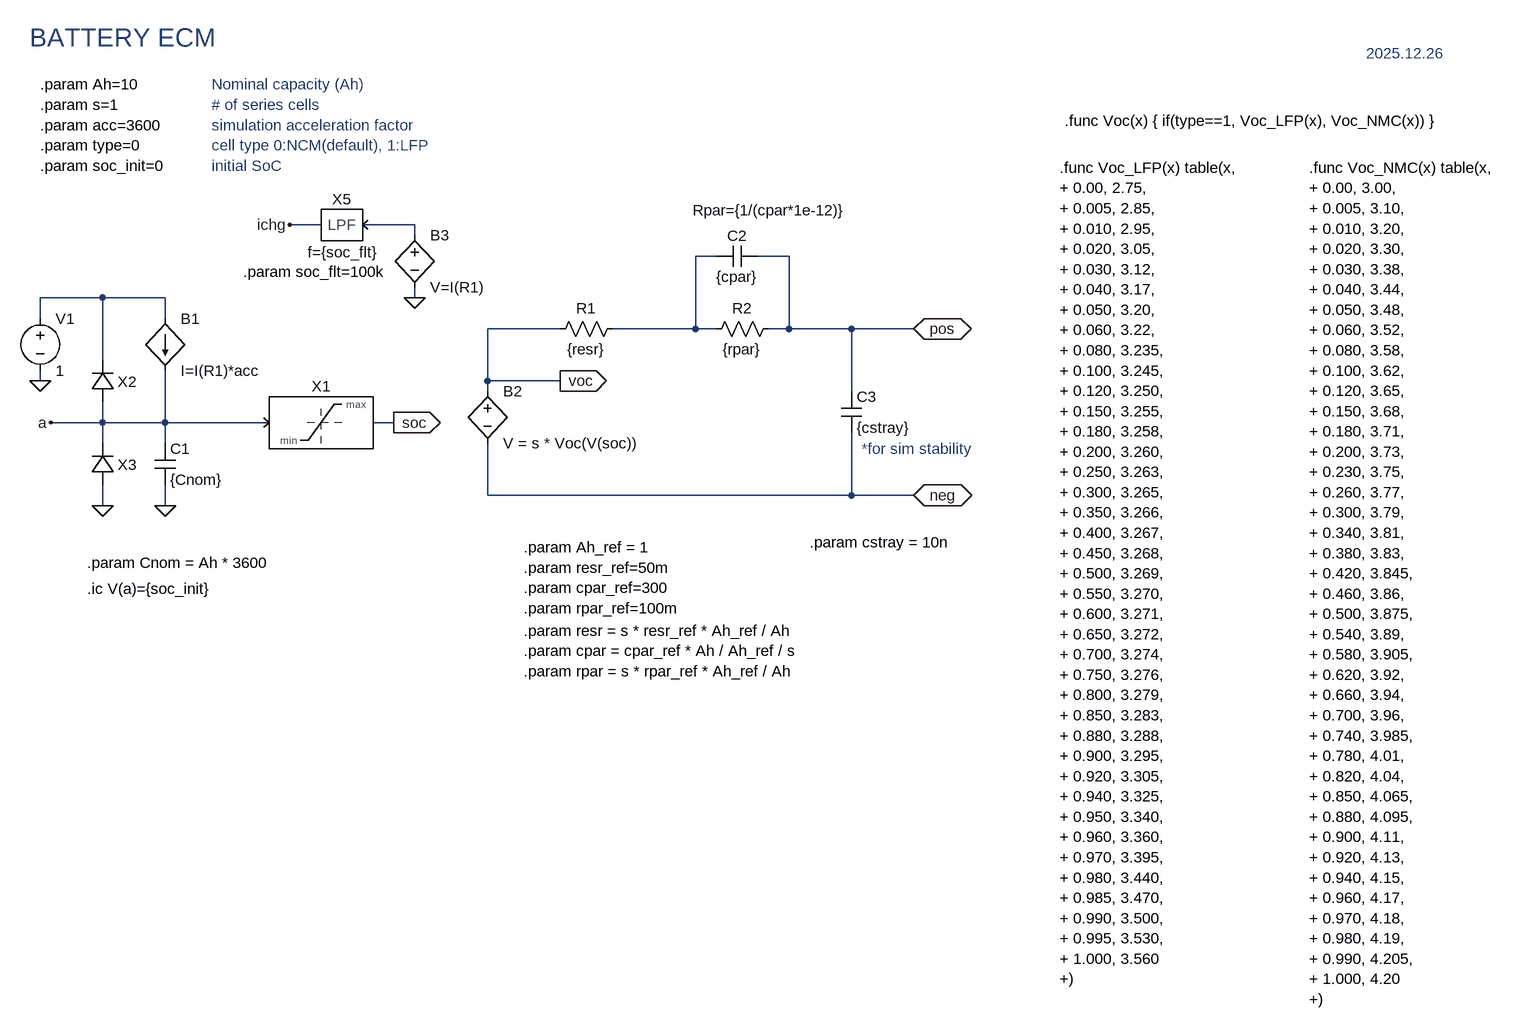
[diagram p0: schematic BATTERY_ECM.asc]
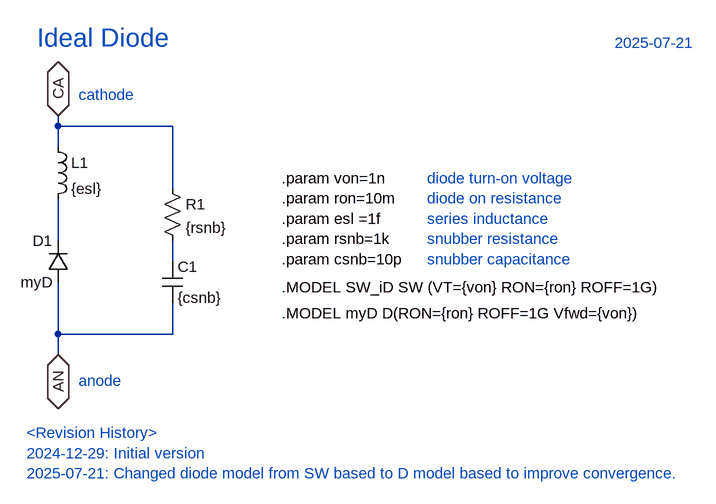
[diagram p1: sub-circuit id.asc]
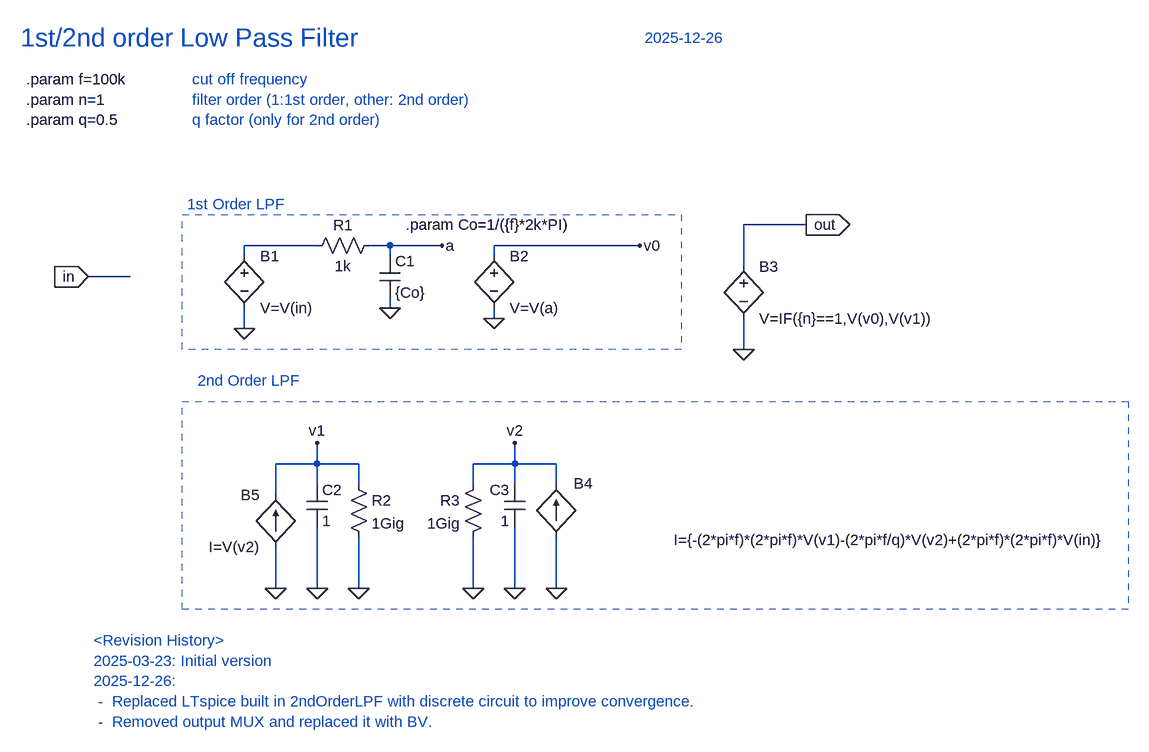
[diagram p2: sub-circuit lpf.asc]
BATTERY_ECM.asc, the LTspice schematic file:
Version 4.1
SHEET 1 1876 1176
WIRE 48 -176 0 -176
WIRE 192 -176 112 -176
WIRE 192 -160 192 -176
WIRE 656 -128 624 -128
WIRE 768 -128 720 -128
WIRE -288 -64 -384 -64
WIRE -192 -64 -288 -64
WIRE 192 -64 192 -80
WIRE -384 -32 -384 -64
WIRE -192 -32 -192 -64
WIRE 416 -16 304 -16
WIRE 624 -16 624 -128
WIRE 624 -16 496 -16
WIRE 656 -16 624 -16
WIRE 768 -16 768 -128
WIRE 768 -16 736 -16
WIRE 864 -16 768 -16
WIRE 960 -16 864 -16
WIRE -288 32 -288 -64
WIRE -384 64 -384 48
WIRE 304 64 304 -16
WIRE 416 64 304 64
WIRE 304 80 304 64
WIRE 864 80 864 -16
WIRE -288 128 -288 96
WIRE -288 128 -368 128
WIRE -192 128 -192 48
WIRE -192 128 -288 128
WIRE -32 128 -192 128
WIRE 160 128 128 128
WIRE -288 160 -288 128
WIRE -192 160 -192 128
WIRE 304 240 304 160
WIRE 864 240 864 144
WIRE 864 240 304 240
WIRE 960 240 864 240
WIRE -288 256 -288 224
WIRE -192 256 -192 224
FLAG -192 256 0
FLAG 160 128 soc
IOPIN 160 128 Out
FLAG -384 64 0
FLAG 416 64 voc
IOPIN 416 64 Out
FLAG 960 240 neg
IOPIN 960 240 BiDir
FLAG 960 -16 pos
IOPIN 960 -16 BiDir
FLAG -368 128 a
FLAG -288 256 0
FLAG 0 -176 ichg
FLAG 192 -64 0
SYMBOL cap -208 160 R0
SYMATTR InstName C1
SYMATTR Value {Cnom}
SYMATTR SpiceLine Rpar=10000Gig
SYMBOL bi -192 -32 R0
SYMATTR InstName B1
SYMATTR Value I=I(R1)*acc
SYMBOL voltage -384 -48 R0
WINDOW 123 0 0 Left 0
WINDOW 39 0 0 Left 0
SYMATTR InstName V1
SYMATTR Value 1
SYMBOL bv 304 64 R0
SYMATTR InstName B2
SYMATTR Value V = s * Voc(V(soc))
SYMBOL res 512 -32 R90
WINDOW 0 0 56 VBottom 2
WINDOW 3 32 56 VTop 2
SYMATTR InstName R1
SYMATTR Value {resr}
SYMBOL res 752 -32 R90
WINDOW 0 0 56 VBottom 2
WINDOW 3 32 56 VTop 2
SYMATTR InstName R2
SYMATTR Value {rpar}
SYMBOL cap 720 -144 R90
WINDOW 0 0 32 VBottom 2
WINDOW 3 32 32 VTop 2
WINDOW 39 -39 -19 VBottom 2
SYMATTR InstName C2
SYMATTR Value {cpar}
SYMATTR SpiceLine Rpar={1/(cpar*1e-12)}
SYMBOL PowerSim\\LIMIT 48 128 R0
SYMATTR InstName X1
SYMBOL iD -288 64 R180
SYMATTR InstName X2
SYMATTR Value von=1n ron=1n
SYMBOL iD -288 192 R180
SYMATTR InstName X3
SYMATTR Value von=1n ron=1n
SYMBOL PowerSim\\LPF 80 -176 M0
WINDOW 3 -1 58 Bottom 2
SYMATTR Value f={soc_flt}
SYMATTR InstName X5
SYMBOL bv 192 -176 R0
SYMATTR InstName B3
SYMATTR Value V=I(R1)
SYMBOL cap 848 80 R0
SYMATTR InstName C3
SYMATTR Value {cstray}
TEXT 1184 -264 Left 2 !.func Voc_LFP(x) table(x,\n+ 0.00, 2.75,\n+ 0.005, 2.85,\n+ 0.010, 2.95,\n+ 0.020, 3.05,\n+ 0.030, 3.12,\n+ 0.040, 3.17,\n+ 0.050, 3.20,\n+ 0.060, 3.22,\n+ 0.080, 3.235,\n+ 0.100, 3.245,\n+ 0.120, 3.250,\n+ 0.150, 3.255,\n+ 0.180, 3.258,\n+ 0.200, 3.260,\n+ 0.250, 3.263,\n+ 0.300, 3.265,\n+ 0.350, 3.266,\n+ 0.400, 3.267,\n+ 0.450, 3.268,\n+ 0.500, 3.269,\n+ 0.550, 3.270,\n+ 0.600, 3.271,\n+ 0.650, 3.272,\n+ 0.700, 3.274,\n+ 0.750, 3.276,\n+ 0.800, 3.279,\n+ 0.850, 3.283,\n+ 0.880, 3.288,\n+ 0.900, 3.295,\n+ 0.920, 3.305,\n+ 0.940, 3.325,\n+ 0.950, 3.340,\n+ 0.960, 3.360,\n+ 0.970, 3.395,\n+ 0.980, 3.440,\n+ 0.985, 3.470,\n+ 0.990, 3.500,\n+ 0.995, 3.530,\n+ 1.000, 3.560\n+)
TEXT -384 -392 Left 2 !.param Ah=10\n.param s=1\n.param acc=3600\n.param type=0\n.param soc_init=0
TEXT -120 -392 Left 2 ;Nominal capacity (Ah)\n# of series cells\nsimulation acceleration factor\ncell type 0:NCM(default), 1:LFP\ninitial SoC
TEXT 360 320 Left 2 !.param Ah_ref = 1\n.param resr_ref=50m\n.param cpar_ref=300\n.param rpar_ref=100m
TEXT 360 448 Left 2 !.param resr = s * resr_ref * Ah_ref / Ah\n.param cpar = cpar_ref * Ah / Ah_ref / s\n.param rpar = s * rpar_ref * Ah_ref / Ah
TEXT -312 344 Left 2 !.param Cnom = Ah * 3600
TEXT 1192 -336 Left 2 !.func Voc(x) { if(type==1, Voc_LFP(x), Voc_NMC(x)) }
TEXT 1568 -264 Left 2 !.func Voc_NMC(x) table(x,\n+ 0.00, 3.00,\n+ 0.005, 3.10,\n+ 0.010, 3.20,\n+ 0.020, 3.30,\n+ 0.030, 3.38,\n+ 0.040, 3.44,\n+ 0.050, 3.48,\n+ 0.060, 3.52,\n+ 0.080, 3.58,\n+ 0.100, 3.62,\n+ 0.120, 3.65,\n+ 0.150, 3.68,\n+ 0.180, 3.71,\n+ 0.200, 3.73,\n+ 0.230, 3.75,\n+ 0.260, 3.77,\n+ 0.300, 3.79,\n+ 0.340, 3.81,\n+ 0.380, 3.83,\n+ 0.420, 3.845,\n+ 0.460, 3.86,\n+ 0.500, 3.875,\n+ 0.540, 3.89,\n+ 0.580, 3.905,\n+ 0.620, 3.92,\n+ 0.660, 3.94,\n+ 0.700, 3.96,\n+ 0.740, 3.985,\n+ 0.780, 4.01,\n+ 0.820, 4.04,\n+ 0.850, 4.065,\n+ 0.880, 4.095,\n+ 0.900, 4.11,\n+ 0.920, 4.13,\n+ 0.940, 4.15,\n+ 0.960, 4.17,\n+ 0.970, 4.18,\n+ 0.980, 4.19,\n+ 0.990, 4.205,\n+ 1.000, 4.20\n+)
TEXT -312 384 Left 2 !.ic V(a)={soc_init}
TEXT -400 -464 Left 4 ;BATTERY ECM
TEXT 1656 -440 Left 2 ;2025.12.26
TEXT -72 -104 Left 2 !.param soc_flt=100k
TEXT 800 312 Left 2 !.param cstray = 10n
TEXT 880 168 Left 2 ;*for sim stability

id.asc, the sub-circuit schematic file:
Version 4.1
SHEET 1 1728 680
WIRE 624 -288 624 -304
WIRE 800 -288 624 -288
WIRE 624 -256 624 -288
WIRE 800 -192 800 -288
WIRE 624 -112 624 -176
WIRE 800 -80 800 -112
WIRE 624 32 624 -48
WIRE 800 32 800 -16
WIRE 800 32 624 32
WIRE 624 64 624 32
FLAG 624 -304 CA
IOPIN 624 -304 BiDir
FLAG 624 64 AN
IOPIN 624 64 BiDir
SYMBOL res 784 -208 R0
SYMATTR InstName R1
SYMATTR Value {rsnb}
SYMBOL cap 784 -80 R0
SYMATTR InstName C1
SYMATTR Value {csnb}
SYMBOL ind 608 -272 R0
SYMATTR InstName L1
SYMATTR Value {esl}
SYMBOL diode 640 -48 R180
WINDOW 0 24 64 Left 2
WINDOW 3 24 0 Left 2
SYMATTR InstName D1
SYMATTR Value myD
TEXT 968 -40 Left 2 !.MODEL SW_iD SW (VT={von} RON={ron} ROFF=1G)
TEXT 968 -208 Left 2 !.param von=1n\n.param ron=10m\n.param esl =1f\n.param rsnb=1k\n.param csnb=10p
TEXT 592 -424 Left 4 ;Ideal Diode
TEXT 656 -336 Left 2 ;cathode
TEXT 656 104 Left 2 ;anode
TEXT 1192 -208 Left 2 ;diode turn-on voltage\ndiode on resistance\nseries inductance\nsnubber resistance\nsnubber capacitance
TEXT 1480 -416 Left 2 ;2025-07-21
TEXT 576 184 Left 2 ;<Revision History>\n2024-12-29: Initial version\n2025-07-21: Changed diode model from SW based to D model based to improve convergence.
TEXT 968 0 Left 2 !.MODEL myD D(RON={ron} ROFF=1G Vfwd={von})

lpf.asc, the sub-circuit schematic file:
Version 4.1
SHEET 1 1652 804
WIRE 944 -80 848 -80
WIRE 192 -48 80 -48
WIRE 304 -48 272 -48
WIRE 384 -48 304 -48
WIRE 688 -48 464 -48
WIRE 80 -32 80 -48
WIRE 304 -32 304 -48
WIRE 464 -32 464 -48
WIRE 848 -16 848 -80
WIRE -96 0 -160 0
WIRE 304 48 304 32
WIRE 464 64 464 48
WIRE 80 80 80 48
WIRE 848 112 848 64
WIRE 192 288 192 256
WIRE 192 288 128 288
WIRE 256 288 192 288
WIRE 496 288 496 256
WIRE 496 288 432 288
WIRE 560 288 496 288
WIRE 192 320 192 288
WIRE 256 320 256 288
WIRE 432 320 432 288
WIRE 496 320 496 288
WIRE 560 320 560 288
WIRE 128 336 128 288
WIRE 128 480 128 416
WIRE 192 480 192 384
WIRE 256 480 256 400
WIRE 432 480 432 400
WIRE 496 480 496 384
WIRE 560 480 560 400
FLAG -160 0 in
IOPIN -160 0 In
FLAG 944 -80 out
IOPIN 944 -80 Out
FLAG 304 48 0
FLAG 80 80 0
FLAG 384 -48 a
FLAG 464 64 0
FLAG 848 112 0
FLAG 256 480 0
FLAG 192 256 v1
FLAG 496 256 v2
FLAG 128 480 0
FLAG 560 480 0
FLAG 688 -48 v0
FLAG 192 480 0
FLAG 496 480 0
FLAG 432 480 0
SYMBOL res 288 -64 R90
WINDOW 0 0 56 VBottom 2
WINDOW 3 32 56 VTop 2
SYMATTR InstName R1
SYMATTR Value 1k
SYMBOL cap 288 -32 R0
SYMATTR InstName C1
SYMATTR Value {Co}
SYMBOL bv 80 -48 R0
SYMATTR InstName B1
SYMATTR Value V=V(in)
SYMBOL bv 464 -48 R0
SYMATTR InstName B2
SYMATTR Value V=V(a)
SYMBOL bv 848 -32 R0
SYMATTR InstName B3
SYMATTR Value V=IF({n}==1,V(v0),V(v1))
SYMBOL res 240 304 R0
SYMATTR InstName R2
SYMATTR Value 1Gig
SYMBOL cap 176 320 R0
SYMATTR InstName C2
SYMATTR Value 1
SYMBOL bi 128 416 R180
WINDOW 0 24 80 Left 2
WINDOW 3 24 0 Left 2
SYMATTR InstName B5
SYMATTR Value I=V(v2)
SYMBOL res 448 304 M0
SYMATTR InstName R3
SYMATTR Value 1Gig
SYMBOL cap 512 320 M0
SYMATTR InstName C3
SYMATTR Value 1
SYMBOL bi 560 400 R180
WINDOW 3 -848 -5 Left 2
WINDOW 0 -56 82 Left 2
SYMATTR Value I={-(2*pi*f)*(2*pi*f)*V(v1)-(2*pi*f/q)*V(v2)+(2*pi*f)*(2*pi*f)*V(in)}
SYMATTR InstName B4
TEXT -264 -368 Left 4 ;1st/2nd order Low Pass Filter
TEXT 696 -368 Left 2 ;2025-12-26
TEXT -256 -304 Left 2 !.param f=100k\n.param n=1\n.param q=0.5
TEXT 328 -80 Left 2 !.param Co=1/({f}*2k*PI)
TEXT 0 -304 Left 2 ;cut off frequency\nfilter order (1:1st order, other: 2nd order)\nq factor (only for 2nd order)
TEXT -8 -112 Left 2 ;1st Order LPF
TEXT 8 160 Left 2 ;2nd Order LPF
TEXT -152 560 Left 2 ;<Revision History>\n2025-03-23: Initial version\n2025-12-26: \n -  Replaced LTspice built in 2ndOrderLPF with discrete circuit to improve convergence.\n -  Removed output MUX and replaced it with BV.
RECTANGLE Normal 752 112 -16 -96 2
RECTANGLE Normal 1440 512 -16 192 2

The netlist it stands for:
* BATTERY_ECM.asc
C1 a 0 {Cnom} Rpar=10000Gig
B1 N003 a I=I(R1)*acc
V1 N003 0 1
B2 voc neg V = s * Voc(V(soc))
R1 N002 voc {resr}
R2 pos N002 {rpar}
C2 pos N002 {cpar} Rpar={1/(cpar*1e-12)}
X§X1 a soc LIMIT max=1 min=0  ; pins in out
X§X2 a N003 id params: von=1n ron=1n esl=1f rsnb=1k csnb=10p
X§X3 0 a id params: von=1n ron=1n esl=1f rsnb=1k csnb=10p
X§X5 N001 ichg lpf params: f={soc_flt} n=1 q=0.5
B3 N001 0 V=I(R1)
C3 pos neg {cstray}

* block symbol definitions
.subckt id AN CA
R1 CA N002 {rsnb}
C1 N002 AN {csnb}
L1 CA N001 {esl}
D1 AN N001 myD
.MODEL SW_iD SW (VT={von} RON={ron} ROFF=1G)
.param von=1n
.param ron=10m
.param esl =1f
.param rsnb=1k
.param csnb=10p
* Ideal Diode
* cathode
* anode
* diode turn-on voltage
* diode on resistance
* series inductance
* snubber resistance
* snubber capacitance
* 2025-07-21
* <Revision History>
* 2024-12-29: Initial version
* 2025-07-21: Changed diode model from SW based to D model based to improve convergence.
.MODEL myD D(RON={ron} ROFF=1G Vfwd={von})
.ends id

.subckt lpf in out
R1 a N001 1k
C1 a 0 {Co}
B1 N001 0 V=V(in)
B2 v0 0 V=V(a)
B3 out 0 V=IF({n}==1,V(v0),V(v1))
R2 v1 0 1Gig
C2 v1 0 1
B5 0 v1 I=V(v2)
R3 v2 0 1Gig
C3 v2 0 1
B4 0 v2 I={-(2*pi*f)*(2*pi*f)*V(v1)-(2*pi*f/q)*V(v2)+(2*pi*f)*(2*pi*f)*V(in)}
* 1st/2nd order Low Pass Filter
* 2025-12-26
.param f=100k
.param n=1
.param q=0.5
.param Co=1/({f}*2k*PI)
* cut off frequency
* filter order (1:1st order, other: 2nd order)
* q factor (only for 2nd order)
* 1st Order LPF
* 2nd Order LPF
* <Revision History>
* 2025-03-23: Initial version
* 2025-12-26:
*  -  Replaced LTspice built in 2ndOrderLPF with discrete circuit to improve convergence.
*  -  Removed output MUX and replaced it with BV.
.ends lpf

.model D D
.lib standard.dio
.func Voc_LFP(x) table(x,
+ 0.00, 2.75,
+ 0.005, 2.85,
+ 0.010, 2.95,
+ 0.020, 3.05,
+ 0.030, 3.12,
+ 0.040, 3.17,
+ 0.050, 3.20,
+ 0.060, 3.22,
+ 0.080, 3.235,
+ 0.100, 3.245,
+ 0.120, 3.250,
+ 0.150, 3.255,
+ 0.180, 3.258,
+ 0.200, 3.260,
+ 0.250, 3.263,
+ 0.300, 3.265,
+ 0.350, 3.266,
+ 0.400, 3.267,
+ 0.450, 3.268,
+ 0.500, 3.269,
+ 0.550, 3.270,
+ 0.600, 3.271,
+ 0.650, 3.272,
+ 0.700, 3.274,
+ 0.750, 3.276,
+ 0.800, 3.279,
+ 0.850, 3.283,
+ 0.880, 3.288,
+ 0.900, 3.295,
+ 0.920, 3.305,
+ 0.940, 3.325,
+ 0.950, 3.340,
+ 0.960, 3.360,
+ 0.970, 3.395,
+ 0.980, 3.440,
+ 0.985, 3.470,
+ 0.990, 3.500,
+ 0.995, 3.530,
+ 1.000, 3.560
+)
.param Ah=10
.param s=1
.param acc=3600
.param type=0
.param soc_init=0
* Nominal capacity (Ah)
* # of series cells
* simulation acceleration factor
* cell type 0:NCM(default), 1:LFP
* initial SoC
.param Ah_ref = 1
.param resr_ref=50m
.param cpar_ref=300
.param rpar_ref=100m
.param resr = s * resr_ref * Ah_ref / Ah
.param cpar = cpar_ref * Ah / Ah_ref / s
.param rpar = s * rpar_ref * Ah_ref / Ah
.param Cnom = Ah * 3600
.func Voc(x) { if(type==1, Voc_LFP(x), Voc_NMC(x)) }
.func Voc_NMC(x) table(x,
+ 0.00, 3.00,
+ 0.005, 3.10,
+ 0.010, 3.20,
+ 0.020, 3.30,
+ 0.030, 3.38,
+ 0.040, 3.44,
+ 0.050, 3.48,
+ 0.060, 3.52,
+ 0.080, 3.58,
+ 0.100, 3.62,
+ 0.120, 3.65,
+ 0.150, 3.68,
+ 0.180, 3.71,
+ 0.200, 3.73,
+ 0.230, 3.75,
+ 0.260, 3.77,
+ 0.300, 3.79,
+ 0.340, 3.81,
+ 0.380, 3.83,
+ 0.420, 3.845,
+ 0.460, 3.86,
+ 0.500, 3.875,
+ 0.540, 3.89,
+ 0.580, 3.905,
+ 0.620, 3.92,
+ 0.660, 3.94,
+ 0.700, 3.96,
+ 0.740, 3.985,
+ 0.780, 4.01,
+ 0.820, 4.04,
+ 0.850, 4.065,
+ 0.880, 4.095,
+ 0.900, 4.11,
+ 0.920, 4.13,
+ 0.940, 4.15,
+ 0.960, 4.17,
+ 0.970, 4.18,
+ 0.980, 4.19,
+ 0.990, 4.205,
+ 1.000, 4.20
+)
.ic V(a)={soc_init}
* BATTERY ECM
* 2025.12.26
.param soc_flt=100k
.param cstray = 10n
* *for sim stability
.backanno
.end